# Altium schematic sheet 3_Power.SchDoc: 24/5/3.3V Power
size A4; DrawnBy: Denis Cooper; Organization: felinefeast.org; Revision: 1.0; SheetNumber: 3; SheetTotal: 5
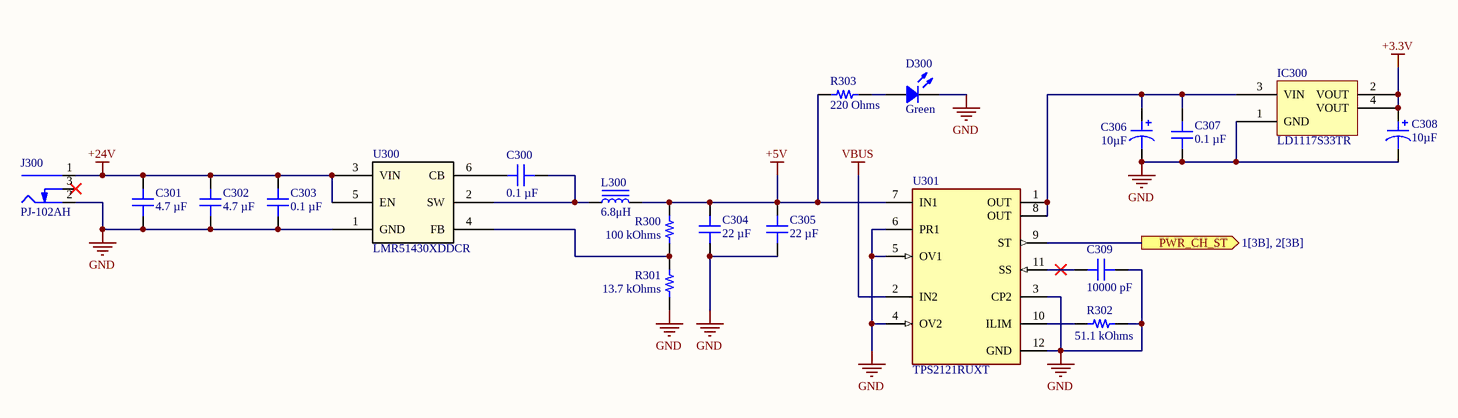
[diagram p0: 3_Power.SchDoc]

## Parts
C300  0.1 µF  [CAP 0603_1608]
C301  4.7 µF  [CAP 1206_3216 - 0.8MM]
C302  4.7 µF  [CAP 1206_3216 - 0.8MM]
C303  0.1 µF  [CAP 0603_1608]
C304  22 µF  [CAP 1210_3225 - 1MM]
C305  22 µF  [CAP 1210_3225 - 1MM]
C306  10µF  [CAP POL 1206_3216]
C307  0.1 µF  [CAP 0603_1608]
C308  10µF  [CAP POL 1206_3216]
C309  10000 pF  [CAP 0603_1608]
D300  Green  [LED 0603_1608 GREEN]
IC300  LD1117S33TR  [ST SOT-223]
J300  PJ-102AH  [CUI PJ-102AH]
L300  Inductance: 6.8μH  [SL0624-6R8M]  (hidden comment: SL0624-6R8M)
R300  100 kOhms  [RES 0603_1608]
R301  13.7 kOhms  [RES 0603_1608]
R302  51.1 kOhms  [RES 0603_1608]
R303  220 Ohms  [RES 0603_1608]
U300  LMR51430XDDCR  [SOT-23-THIN-6_DDC_TEX]
U301  TPS2121RUXT  [FP-RUX0012A-MFG]

## Ports
PWR_CH_ST (out, see 1[3B], 2[3B])

## Nets
+3.3V: C308.1 IC300.2(VOUT) IC300.4(VOUT)
+5V: C304.2 C305.2 L300.2 R300.2 R303.2 U301.7(IN1)
+24V: C301.2 C302.2 C303.2 J300.1(Centre) U300.3(VIN) U300.5(EN)
GND: C301.1 C302.1 C303.1 C304.1 C305.1 C306.2 C307.1 C308.2 C309.1 D300.2 IC300.1(GND) J300.2(Outer) R301.1 R302.1 U300.1(GND) U301.3(CP2) U301.4(OV2) U301.5(OV1) U301.6(PR1) U301.12(GND)
VBUS: U301.2(IN2)
PWR_CH_ST: U301.9(ST) ; port PWR_CH_ST
NetC300_1: C300.1 L300.1 U300.2(SW)
NetC300_2: C300.2 U300.6(CB)
NetC306_1: C306.1 C307.2 IC300.3(VIN) U301.1(OUT) U301.8(OUT)
NetC309_2: C309.2 U301.11(SS)
NetD300_1: D300.1 R303.1
NetR300_1: R300.1 R301.2 U300.4(FB)
NetR302_2: R302.2 U301.10(ILIM)

Not connected (* = marked no-connect by the designer): J300 3(SW)*

## Library data of the parts
C300 C307 = CL10B104KA8NNNC: CAP CER 0.1UF 25V X7R 0603; manufacturer: Samsung Electro-Mechanics; Tolerance: ±10%; Part Number: CL10B104KA8NNNC; Capacitance: 0.1 µF; Applications: General Purpose; componentlink1description: Datasheet; componentlink1url: http://www.samsungsem.com/kr/support/product-search/mlcc/CL10B104KA8NNNC.jsp; componentlink2description: DigiKey Link; componentlink2url: https://www.digikey.com/en/products/detail/samsung-electro-mechanics/CL10B104KA8NNNC/3886664; Device Package: 0603 (1608 Metric); lastupdated: 09.02.2024 20:10:20; Lifecycle Status: Active; Minimum Order: 1; Mounting Type: Surface Mount, MLCC; Operating Temperature: -55°C ~ 125°C; Package / Case: 0603 (1608 Metric); packaging: TapeAndReel; partid: 9793; Part Status: Active; price: 0.01; series: CL; Size / Dimension: 0.063" L x 0.031" W (1.60mm x 0.80mm); Supplier 1: DigiKey; Supplier Part Number 1: 1276-1006-1-ND; Temperature Coefficient: X7R; Thickness (Max): 0.035" (0.90mm); value: 0.1 µF; Voltage - Rated: 25V
C301 C302 = CL31B475KBHNNNE: CAP CER 4.7UF 50V X7R 1206; manufacturer: Samsung Electro-Mechanics; Tolerance: ±10%; Part Number: CL31B475KBHNNNE; Capacitance: 4.7 µF; Applications: General Purpose; componentlink1description: Datasheet; componentlink1url: http://www.samsungsem.com/kr/support/product-search/mlcc/CL31B475KBHNNNE.jsp; componentlink2description: DigiKey Link; componentlink2url: https://www.digikey.com/en/products/detail/samsung-electro-mechanics/CL31B475KBHNNNE/3888447; Device Package: 1206 (3216 Metric); lastupdated: 04.06.2024 19:10:40; Lifecycle Status: Active; Minimum Order: 1; Mounting Type: Surface Mount, MLCC; Operating Temperature: -55°C ~ 125°C; Package / Case: 1206 (3216 Metric); packaging: TapeAndReel; partid: 40975; Part Status: Active; price: 0.05; series: CL; Size / Dimension: 0.126" L x 0.063" W (3.20mm x 1.60mm); Supplier 1: DigiKey; Supplier Part Number 1: 1276-2789-1-ND; Temperature Coefficient: X7R; Thickness (Max): 0.071" (1.80mm); value: 4.7 µF; Voltage - Rated: 50V
C303 = CL10B104KB8NNNC: CAP CER 0.1UF 50V X7R 0603; manufacturer: Samsung Electro-Mechanics; Tolerance: ±10%; Part Number: CL10B104KB8NNNC; Capacitance: 0.1 µF; Applications: General Purpose; componentlink1description: Datasheet; componentlink1url: http://www.samsungsem.com/kr/support/product-search/mlcc/CL10B104KB8NNNC.jsp; componentlink2description: DigiKey Link; componentlink2url: https://www.digikey.com/en/products/detail/samsung-electro-mechanics/CL10B104KB8NNNC/3886658; Device Package: 0603 (1608 Metric); lastupdated: 09.02.2024 20:10:20; Lifecycle Status: Active; Minimum Order: 1; Mounting Type: Surface Mount, MLCC; Operating Temperature: -55°C ~ 125°C; Package / Case: 0603 (1608 Metric); packaging: TapeAndReel; partid: 9788; Part Status: Active; price: 0.01; series: CL; Size / Dimension: 0.063" L x 0.031" W (1.60mm x 0.80mm); Supplier 1: DigiKey; Supplier Part Number 1: 1276-1000-1-ND; Temperature Coefficient: X7R; Thickness (Max): 0.035" (0.90mm); value: 0.1 µF; Voltage - Rated: 50V
C304 C305 = CL32B226KAJNNNE: CAP CER 22UF 25V X7R 1210; manufacturer: Samsung Electro-Mechanics; Tolerance: ±10%; Part Number: CL32B226KAJNNNE; Value: 22 µF; Applications: General Purpose; Capacitance: 22 µF; componentlink1description: Datasheet; componentlink1url: http://www.samsungsem.com/kr/support/product-search/mlcc/CL32B226KAJNNNE.jsp; componentlink2description: DigiKey Link; componentlink2url: https://www.digikey.com/en/products/detail/samsung-electro-mechanics/CL32B226KAJNNNE/3889050; Device Package: 1210 (3225 Metric); lastupdated: 04.06.2024 19:21:03; Lifecycle Status: Active; Minimum Order: 1; Mounting Type: Surface Mount, MLCC; Operating Temperature: -55°C ~ 125°C; Package / Case: 1210 (3225 Metric); packaging: TapeAndReel; partid: 39957; Part Status: Active; price: 0.13; series: CL; Size / Dimension: 0.126" L x 0.098" W (3.20mm x 2.50mm); Supplier 1: DigiKey; Supplier Part Number 1: 1276-3392-1-ND; Temperature Coefficient: X7R; Thickness (Max): 0.106" (2.70mm); Voltage - Rated: 25V
C306 C308 = TAJA106K016RNJ: CAP TANT 10UF 10% 16V 1206; manufacturer: AVX Corporation; Manufacturer Size Code: A; ESR (Equivalent Series Resistance): 3Ohm; Type: Molded; Part Number: TAJA106K016RNJ; Value: 10µF; Capacitance: 10µF; componentlink1description: Datasheet; componentlink1url: http://datasheets.avx.com/TAJ.pdf; componentlink2description: DigiKey Link; componentlink2url: http://digikey.com/product-detail/en/avx-corporation/TAJA106K016RNJ/478-1655-1-ND/564687; Device Package: 1206 (3216 Metric); Features: General Purpose; Height - Seated (Max): 0.071" (1.80mm); lastupdated: 02.09.2020 1:15:58; Lifecycle Status: Active; Minimum Order: 1; Mounting Type: Surface Mount; Operating Temperature: -55°C ~ 125°C; Package / Case: 1206 (3216 Metric); packaging: TapeAndReel; partid: 412; Part Status: Active; price: 0.10; series: TAJ; Size / Dimension: 0.126" L x 0.063" W (3.20mm x 1.60mm); Supplier 1: DigiKey; Supplier Part Number 1: 478-1655-1-ND; Tolerance: ±10%; Voltage - Rated: 16V
C309 = CL10B103KB8NNNC: CAP CER 10000PF 50V X7R 0603; manufacturer: Samsung Electro-Mechanics; Tolerance: ±10%; Part Number: CL10B103KB8NNNC; Capacitance: 10000 pF; Applications: General Purpose; componentlink1description: Datasheet; componentlink1url: http://www.samsungsem.com/kr/support/product-search/mlcc/CL10B103KB8NNNC.jsp; componentlink2description: DigiKey Link; componentlink2url: https://www.digikey.com/en/products/detail/samsung-electro-mechanics/CL10B103KB8NNNC/3886667; Device Package: 0603 (1608 Metric); lastupdated: 09.02.2024 20:10:26; Lifecycle Status: Active; Minimum Order: 1; Mounting Type: Surface Mount, MLCC; Operating Temperature: -55°C ~ 125°C; Package / Case: 0603 (1608 Metric); packaging: TapeAndReel; partid: 5498; Part Status: Active; price: 0.01; series: CL; Size / Dimension: 0.063" L x 0.031" W (1.60mm x 0.80mm); Supplier 1: DigiKey; Supplier Part Number 1: 1276-1009-1-ND; Temperature Coefficient: X7R; Thickness (Max): 0.035" (0.90mm); value: 10000 pF; Voltage - Rated: 50V
D300 = APT1608CGCK: LED GREEN CLEAR CHIP SMD; Manufacturer: Kingbright; Configuration: Standard; Current - Test: 20mA; Lens Color: Colorless; Lens Size: 1.20mm x 0.80mm; Lens Style: Rectangle with Flat Top; Millicandela Rating: 50mcd; Viewing Angle: 120°; Voltage - Forward (Vf) (Typ): 2.1V; Wavelength - Dominant: 570nm; Wavelength - Peak: 574nm; Part Number: APT1608CGCK; Color: Green; ComponentLink1Description: Datasheet; ComponentLink1URL: http://www.kingbrightusa.com/images/catalog/SPEC/APT1608CGCK.pdf; ComponentLink2Description: DigiKey Link; ComponentLink2URL: https://www.digikey.com/en/products/detail/kingbright/APT1608CGCK/1747514; Device Package: 0603 (1608 Metric); Height (Max): 0.75mm; LastUpdated: 25.08.2025 20:35:24; Lens Transparency: Clear; Lifecycle Status: Active; Minimum Order: 1; Mounting Type: Surface Mount; Package / Case: 0603 (1608 Metric); Packaging: TapeAndReel; PartId: 664; Part Status: Active; Price: 0.05; Series: -; Size / Dimension: 1.60mm L x 0.80mm W; Supplier 1: DigiKey; Supplier Part Number 1: 754-1116-1-ND; Supplier Device Package: Chip LED; Value: Green
IC300 = LD1117S33TR: IC REG LINEAR 3.3V 800MA SOT223; Manufacturer: STMicroelectronics; Current - Quiescent (Iq): 10 mA; Number of Regulators: 1; Output Configuration: Positive; Output Type: Fixed; Protection Features: Over Current, Over Temperature; PSRR: 75dB (120Hz); Voltage Dropout (Max): 1.2V @ 800mA; Voltage - Input (Max): 15V; Part Number: LD1117S33TR; ComponentLink1Description: Datasheet; ComponentLink1URL: http://www.st.com/content/ccc/resource/technical/document/datasheet/99/3b/7d/91/91/51/4b/be/CD00000544.pdf/files/CD00000544.pdf/jcr:content/translations/en.CD00000544.pdf; ComponentLink2Description: DigiKey Link; ComponentLink2URL: https://www.digikey.com/en/products/detail/stmicroelectronics/LD1117S33TR/585766; Current - Output: 800mA; LastUpdated: 03.06.2024 20:14:20; Lifecycle Status: Active; Minimum Order: 1; Mounting Type: Surface Mount; Operating Temperature: 0°C ~ 125°C; Package / Case: TO-261-4, TO-261AA; Packaging: TapeAndReel; Part Status: Active; Price: 0.13; Series: -; Supplier 1: DigiKey; Supplier Part Number 1: 497-1242-1-ND; Supplier Device Package: SOT-223; Voltage - Output (Min/Fixed): 3.3V
J300 = PJ-102AH: CONN PWR JACK 2X5.5MM SOLDER; Manufacturer: CUI Devices; Actual Diameter: 0.079" (2.00mm ID), 0.256" (6.50mm OD); Current Rating (Amps): 5A; Gender: Male; Industry Recognized Mating Diameter: 2.00mm ID (0.079"), 5.50mm OD (0.217"); Internal Switch(s): Single Switch, Normally Closed; Material Flammability Rating: UL94 V-0; Mating Length/Depth: 0.354" (9.00mm); Number of Positions/Contacts: 2 Conductors, 3 Contacts; Shielding: Unshielded; Voltage - Rated: 24VDC; Part Number: PJ-102AH; ComponentLink1Description: Datasheet; ComponentLink1URL: https://www.cuidevices.com/product/resource/digikeypdf/pj-102ah.pdf; ComponentLink2Description: DigiKey Link; ComponentLink2URL: //digikey.com/product-detail/en/cui-devices/PJ-102AH/CP-102AH-ND/408448; Connector Type: Jack; LastUpdated: 16.12.2019 19:01:27; Lifecycle Status: 0; Minimum Order: 1; Mounting Type: Through Hole, Right Angle; Packaging: Tray; Part Status: Active; Price: 0.76; Series: -; Supplier 1: DigiKey; Supplier Part Number 1: CP-102AH-ND; Termination: Solder
L300 = SL0624-6R8M: 4A 5A 6.8uH 70mΩ ±20% SMD,7.1x6.6mm Inductors (SMD) ROHS; Manufacturer: TECHFUSE; Package: SMD,7.1x6.6mm; Current - Saturation (Isat): 5A; Tolerance: ±20%; Current Rating: 4A; DC Resistance (DCR): 70mΩ
R300 = ERJ-3EKF1003V: RES SMD 100K OHM 1% 1/10W 0603; Manufacturer: Panasonic Electronic Components; Power (Watts): 0.1W, 1/10W; Temperature Coefficient: ±100ppm/°C; Part Number: ERJ-3EKF1003V; Value: 100 kOhms; ComponentLink1Description: Datasheet; ComponentLink1URL: https://industrial.panasonic.com/cdbs/www-data/pdf/RDA0000/AOA0000C304.pdf; ComponentLink2Description: DigiKey Link; ComponentLink2URL: https://www.digikey.com/en/products/detail/panasonic-electronic-components/ERJ-3EKF1003V/196075; Composition: Thick Film; Device Package: 0603 (1608 Metric); Features: Automotive AEC-Q200; Height - Seated (Max): 0.022" (0.55mm); LastUpdated: 09.02.2024 20:41:59; Lifecycle Status: Active; Minimum Order: 1; Number of Terminations: 2; Operating Temperature: -55°C ~ 155°C; Package / Case: 0603 (1608 Metric); Packaging: TapeAndReel; PartId: 25699; Part Status: Active; Price: 0.01; Ratings: AEC-Q200; Resistance: 100 kOhms; Series: ERJ-3EK; Size / Dimension: 0.063" L x 0.031" W (1.60mm x 0.80mm); Supplier 1: DigiKey; Supplier Part Number 1: P100KHCT-ND; Supplier Device Package: 0603; Tolerance: ±1%
R301 = ERJ-3EKF1372V: RES SMD 13.7K OHM 1% 1/10W 0603; Manufacturer: Panasonic Electronic Components; Power (Watts): 0.1W, 1/10W; Temperature Coefficient: ±100ppm/°C; Part Number: ERJ-3EKF1372V; Value: 13.7 kOhms; ComponentLink1Description: Datasheet; ComponentLink1URL: https://industrial.panasonic.com/cdbs/www-data/pdf/RDA0000/AOA0000C304.pdf; ComponentLink2Description: DigiKey Link; ComponentLink2URL: https://www.digikey.com/en/products/detail/panasonic-electronic-components/ERJ-3EKF1372V/196114; Composition: Thick Film; Device Package: 0603 (1608 Metric); Features: Automotive AEC-Q200; Height - Seated (Max): 0.022" (0.55mm); LastUpdated: 09.02.2024 20:41:57; Lifecycle Status: Active; Minimum Order: 1; Number of Terminations: 2; Operating Temperature: -55°C ~ 155°C; Package / Case: 0603 (1608 Metric); Packaging: TapeAndReel; PartId: 26000; Part Status: Active; Price: 0.01; Ratings: AEC-Q200; Resistance: 13.7 kOhms; Series: ERJ-3EK; Size / Dimension: 0.063" L x 0.031" W (1.60mm x 0.80mm); Supplier 1: DigiKey; Supplier Part Number 1: P13.7KHCT-ND; Supplier Device Package: 0603; Tolerance: ±1%
R302 = ERA-3AEB5112V: RES SMD 51.1KOHM 0.1% 1/10W 0603; Manufacturer: Panasonic Electronic Components; Power (Watts): 0.1W, 1/10W; Temperature Coefficient: ±25ppm/°C; Part Number: ERA-3AEB5112V; Value: 51.1 kOhms; ComponentLink1Description: Datasheet; ComponentLink1URL: https://industrial.panasonic.com/cdbs/www-data/pdf/RDM0000/AOA0000C307.pdf; ComponentLink2Description: DigiKey Link; ComponentLink2URL: https://www.digikey.com/en/products/detail/panasonic-electronic-components/ERA-3AEB5112V/2026902; Composition: Thin Film; Device Package: 0603 (1608 Metric); Features: Automotive AEC-Q200; Height - Seated (Max): 0.022" (0.55mm); LastUpdated: 09.02.2024 20:42:09; Lifecycle Status: Active; Minimum Order: 1; Number of Terminations: 2; Operating Temperature: -55°C ~ 155°C; Package / Case: 0603 (1608 Metric); Packaging: TapeAndReel; PartId: 24671; Part Status: Active; Price: 0.03; Ratings: AEC-Q200; Resistance: 51.1 kOhms; Series: ERA-3A; Size / Dimension: 0.063" L x 0.031" W (1.60mm x 0.80mm); Supplier 1: DigiKey; Supplier Part Number 1: P51.1KDBCT-ND; Supplier Device Package: 0603; Tolerance: ±0.1%
R303 = ERJ-P03F2200V: RES SMD 220 OHM 1% 1/5W 0603; Manufacturer: Panasonic Electronic Components; Power (Watts): 0.2W, 1/5W; Temperature Coefficient: ±200ppm/°C; Part Number: ERJ-P03F2200V; Value: 220 Ohms; ComponentLink1Description: Datasheet; ComponentLink1URL: https://industrial.panasonic.com/cdbs/www-data/pdf/RDO0000/AOA0000C331.pdf; ComponentLink2Description: DigiKey Link; ComponentLink2URL: https://www.digikey.com/en/products/detail/panasonic-electronic-components/ERJ-P03F2200V/9810390; Composition: Thick Film; Device Package: 0603 (1608 Metric); Features: Automotive AEC-Q200, Pulse Withstanding; Height - Seated (Max): 0.022" (0.55mm); LastUpdated: 09.02.2024 20:40:33; Lifecycle Status: Active; Minimum Order: 1; Number of Terminations: 2; Operating Temperature: -55°C ~ 155°C; Package / Case: 0603 (1608 Metric); Packaging: TapeAndReel; PartId: 82268; Price: 0.03; Ratings: AEC-Q200; Resistance: 220 Ohms; Series: ERJ-P03; Size / Dimension: 0.063" L x 0.031" W (1.60mm x 0.80mm); Supplier 1: DigiKey; Supplier Part Number 1: 10-ERJ-P03F2200VCT-ND; Supplier Device Package: 0603; Tolerance: ±1%
U300 = LMR51430XDDCR: SIMPLE SWITCHER&reg; 4.5-V to 36-V, 3-A synchronous buck converter with 40-&micro;A IQ 6-SOT-23-THIN -40 to 150; Manufacturer_Name: Texas Instruments; Copyright: Copyright (C) 2026 Ultra Librarian. All rights reserved.; Manufacturer_Part_Number: LMR51430XDDCR; RefDes: RefDes; Type: Type
U301 = CMP-04910-000091-1: PWR MGMT BATTERY MGMT